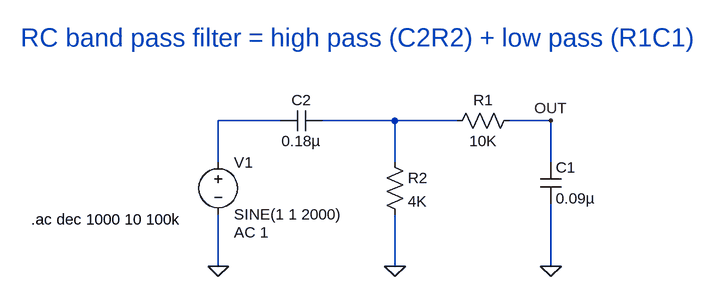
[diagram p0: schematic rc-bandpass-filter-1.asc]
rc-bandpass-filter-1.asc, the LTspice schematic file:
Version 4
SHEET 1 1188 680
WIRE 288 64 192 64
WIRE 464 64 352 64
WIRE 560 64 464 64
WIRE 704 64 640 64
WIRE 192 128 192 64
WIRE 464 128 464 64
WIRE 704 128 704 64
WIRE 192 288 192 208
WIRE 464 288 464 208
WIRE 704 288 704 192
FLAG 192 288 0
FLAG 464 288 0
FLAG 704 288 0
FLAG 704 64 OUT
SYMBOL voltage 192 112 R0
WINDOW 123 24 124 Left 2
WINDOW 39 0 0 Left 2
SYMATTR Value2 AC 1
SYMATTR InstName V1
SYMATTR Value SINE(1 1 2000)
SYMBOL res 656 48 R90
WINDOW 0 0 56 VBottom 2
WINDOW 3 32 56 VTop 2
SYMATTR InstName R1
SYMATTR Value 10K
SYMBOL cap 688 128 R0
SYMATTR InstName C1
SYMATTR Value 0.09µ
SYMBOL cap 352 48 R90
WINDOW 0 0 32 VBottom 2
WINDOW 3 32 32 VTop 2
SYMATTR InstName C2
SYMATTR Value 0.18µ
SYMBOL res 448 112 R0
SYMATTR InstName R2
SYMATTR Value 4K
TEXT -96 216 Left 2 !.ac dec 1000 10 100k
TEXT -112 -64 Left 4 ;RC band pass filter = high pass (C2R2) + low pass (R1C1)

The netlist it stands for:
* rc-bandpass-filter-1.asc
V1 N001 0 SINE(1 1 2000) AC 1
R1 OUT N002 10K
C1 OUT 0 0.09µ
C2 N002 N001 0.18µ
R2 N002 0 4K
.ac dec 1000 10 100k
* RC band pass filter = high pass (C2R2) + low pass (R1C1)
.backanno
.end